# Altium schematic sheet com.SchDoc
size A4
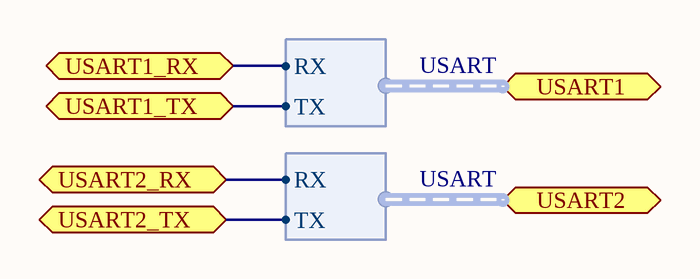
[diagram p0: com.SchDoc]

## Ports
USART1 (harness USART), USART1_RX, USART1_TX, USART2 (harness USART), USART2_RX, USART2_TX

## Harnesses
USART: TX, RX

## Nets
USART1_RX: port USART1_RX, port USART1.RX
USART1_TX: port USART1_TX, port USART1.TX
USART2_RX: port USART2_RX, port USART2.RX
USART2_TX: port USART2_TX, port USART2.TX